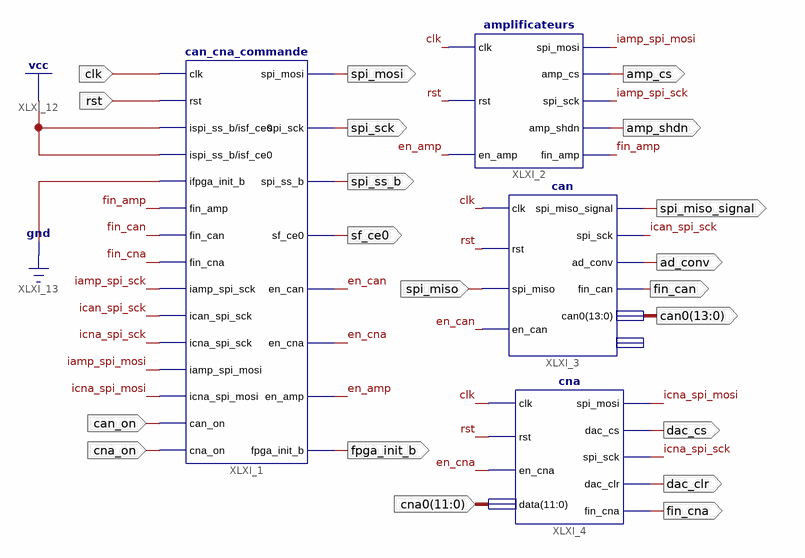
[diagram p0: schematic sheet 1]
// Xilinx ISE schematic convertisseurs.sch (spartan3e) as structural Verilog: 4 symbols, 20 ports
module convertisseurs (
  input  clk,
  input  rst,
  input  spi_miso,
  input  can_on,
  input  cna_on,
  input  [11:0] cna0,
  output fin_can,
  output fin_cna,
  output fpga_init_b,
  output sf_ce0,
  output spi_mosi,
  output spi_sck,
  output spi_ss_b,
  output amp_cs,
  output amp_shdn,
  output spi_miso_signal,
  output ad_conv,
  output [13:0] can0,
  output dac_cs,
  output dac_clr
);

  wire en_amp, en_can, en_cna, fin_amp, iamp_spi_mosi, iamp_spi_sck, ican_spi_sck, icna_spi_mosi,
       icna_spi_sck;

  can_cna_commande XLXI_1 (
    .clk(clk), .rst(rst), .ispi_ss_b(1'b1), .isf_ce0(1'b1), .ifpga_init_b(1'b0), .fin_amp(fin_amp),
    .fin_can(fin_can), .fin_cna(fin_cna), .iamp_spi_sck(iamp_spi_sck), .ican_spi_sck(ican_spi_sck),
    .icna_spi_sck(icna_spi_sck), .iamp_spi_mosi(iamp_spi_mosi), .icna_spi_mosi(icna_spi_mosi),
    .can_on(can_on), .cna_on(cna_on), .spi_mosi(spi_mosi), .spi_sck(spi_sck), .spi_ss_b(spi_ss_b),
    .sf_ce0(sf_ce0), .en_can(en_can), .en_cna(en_cna), .en_amp(en_amp), .fpga_init_b(fpga_init_b));
  amplificateurs XLXI_2 (
    .clk(clk), .rst(rst), .en_amp(en_amp), .spi_mosi(iamp_spi_mosi), .amp_cs(amp_cs), .spi_sck(iamp_spi_sck),
    .amp_shdn(amp_shdn), .fin_amp(fin_amp));
  can XLXI_3 (
    .clk(clk), .rst(rst), .spi_miso(spi_miso), .en_can(en_can), .spi_miso_signal(spi_miso_signal),
    .spi_sck(ican_spi_sck), .ad_conv(ad_conv), .fin_can(fin_can), .can0(can0));  // open: can1
  cna XLXI_4 (
    .clk(clk), .rst(rst), .en_cna(en_cna), .data(cna0), .spi_mosi(icna_spi_mosi), .dac_cs(dac_cs),
    .spi_sck(icna_spi_sck), .dac_clr(dac_clr), .fin_cna(fin_cna));
endmodule
